# Altium schematic sheet ProbadorDeCables_Accesorios_B_CST100_Bomba.SchDoc
size A4
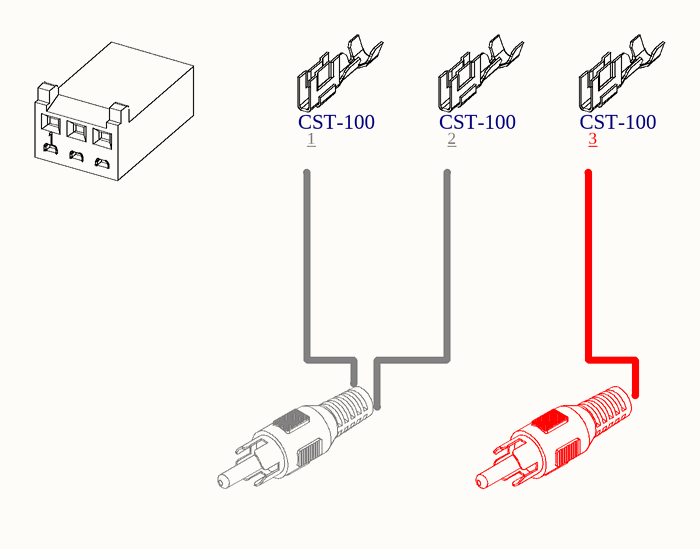
[diagram p0: ProbadorDeCables_Accesorios_B_CST100_Bomba.SchDoc]

## Parts
B_CST100  CST-100-3  [BOM_CST-100-3]  (value not drawn)  (mechanical)
BOM_B_CST100__1  RCP-023__Blanco  [BOM_RCP-023__Blanco]  (value not drawn)  (mechanical)
BOM_B_CST100__2  RCP-022__Rojo  [BOM_RCP-022__Rojo]  (value not drawn)  (mechanical)
BOM_B_CST100__3  ParaHousing: CST-100  [BOM_sock_CST_1375819-1]  (hidden comment: sock_CST_1375819-1)  (mechanical)
BOM_B_CST100__4  ParaHousing: CST-100  [BOM_sock_CST_1375819-1]  (hidden comment: sock_CST_1375819-1)  (mechanical)
BOM_B_CST100__5  ParaHousing: CST-100  [BOM_sock_CST_1375819-1]  (hidden comment: sock_CST_1375819-1)  (mechanical)

## Notes on the sheet
- (near BOM_B_CST100__4) 1
- (near BOM_B_CST100__5) 2
- 3

## Library data of the parts
B_CST100 = CST-100-3: CONN RCPT HSNG 3POS CST-100 II; Cod.Fabricante: 1375820-3; Fabricante: TE Connectivity AMP Connectors; Cod.DigiKey: A99614-ND; ComponentLink1Description: Manufacturer Link; ComponentLink1URL: https://www.te.com/commerce/DocumentDelivery/DDEController?Action=srchrtrv&DocNm=1375820&DocType=Customer+Drawing&DocLang=English; DIGIKEYx50: 0.12620; DIGIKEYx100: 0.11720
BOM_B_CST100__1 = RCP-023__Blanco: CONN RCA PLUG MONO 2COND; Fabricante: CUI Devices; Cod.DigiKey: CP-1455-ND; Cod.Fabricante: RCP-023; ComponentLink1Description: Manufacturer Link; ComponentLink1URL: https://www.cuidevices.com/product/resource/digikeypdf/rcp-02x.pdf; DIGIKEYx50: 1.09940; DIGIKEYx100: 1.05160
BOM_B_CST100__2 = RCP-022__Rojo: CONN RCA PLUG MONO 2COND; Fabricante: CUI Devices; Cod.DigiKey: CP-1454-ND; Cod.Fabricante: RCP-022; ComponentLink1Description: Manufacturer Link; ComponentLink1URL: https://www.cuidevices.com/product/resource/digikeypdf/rcp-02x.pdf; DIGIKEYx50: 1.09940; DIGIKEYx100: 1.05160
BOM_B_CST100__3-BOM_B_CST100__5 = sock_CST_1375819-1: CONN SOCKET 22-26AWG CRIMP TIN; Fabricante: TE Connectivity AMP Connectors; Cod.DigiKey: A100453CT-ND; Cod.Fabricante: 1375819-1; ComponentLink1Description: Manufacturer Link; ComponentLink1URL: https://www.te.com/commerce/DocumentDelivery/DDEController?Action=srchrtrv&DocNm=1375819&DocType=Customer+Drawing&DocLang=English; DIGIKEYx100: 0.04210; DIGIKEYx50: 0.03960